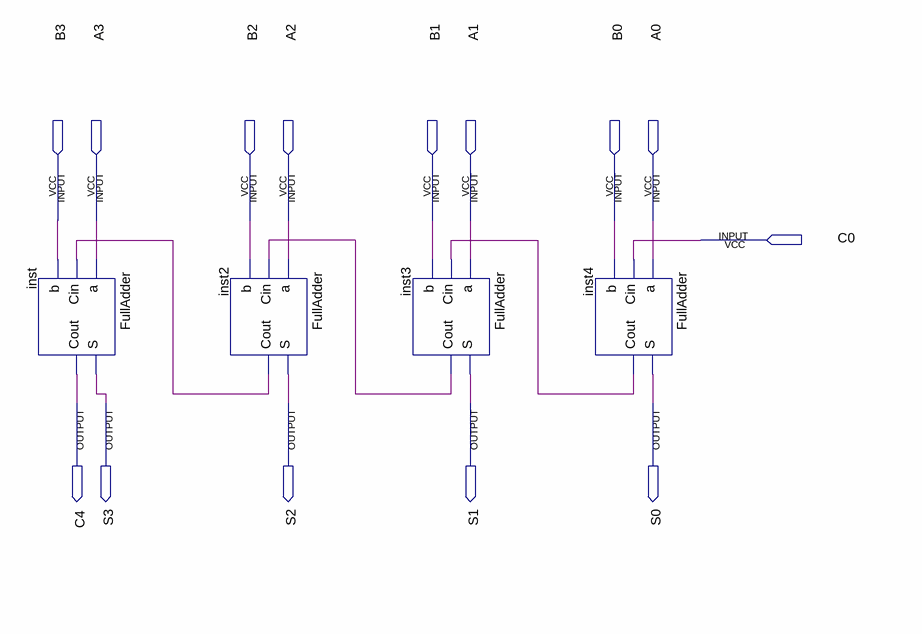
[diagram p0: schematic sheet]
// Quartus schematic FourBitAdder.bdf as structural Verilog: 4 symbols, 14 pins
module FourBitAdder (
  input  B3,
  input  A3,
  input  B2,
  input  A2,
  input  B1,
  input  A1,
  input  B0,
  input  A0,
  input  C0,
  output C4,
  output S3,
  output S2,
  output S1,
  output S0
);

  wire inst2_cout, inst3_cout, inst4_cout;

  FullAdder inst (.a(A3), .Cin(inst2_cout), .b(B3), .S(S3), .Cout(C4));
  FullAdder inst2 (.a(A2), .Cin(inst3_cout), .b(B2), .S(S2), .Cout(inst2_cout));
  FullAdder inst3 (.a(A1), .Cin(inst4_cout), .b(B1), .S(S1), .Cout(inst3_cout));
  FullAdder inst4 (.a(A0), .Cin(C0), .b(B0), .S(S0), .Cout(inst4_cout));
endmodule
